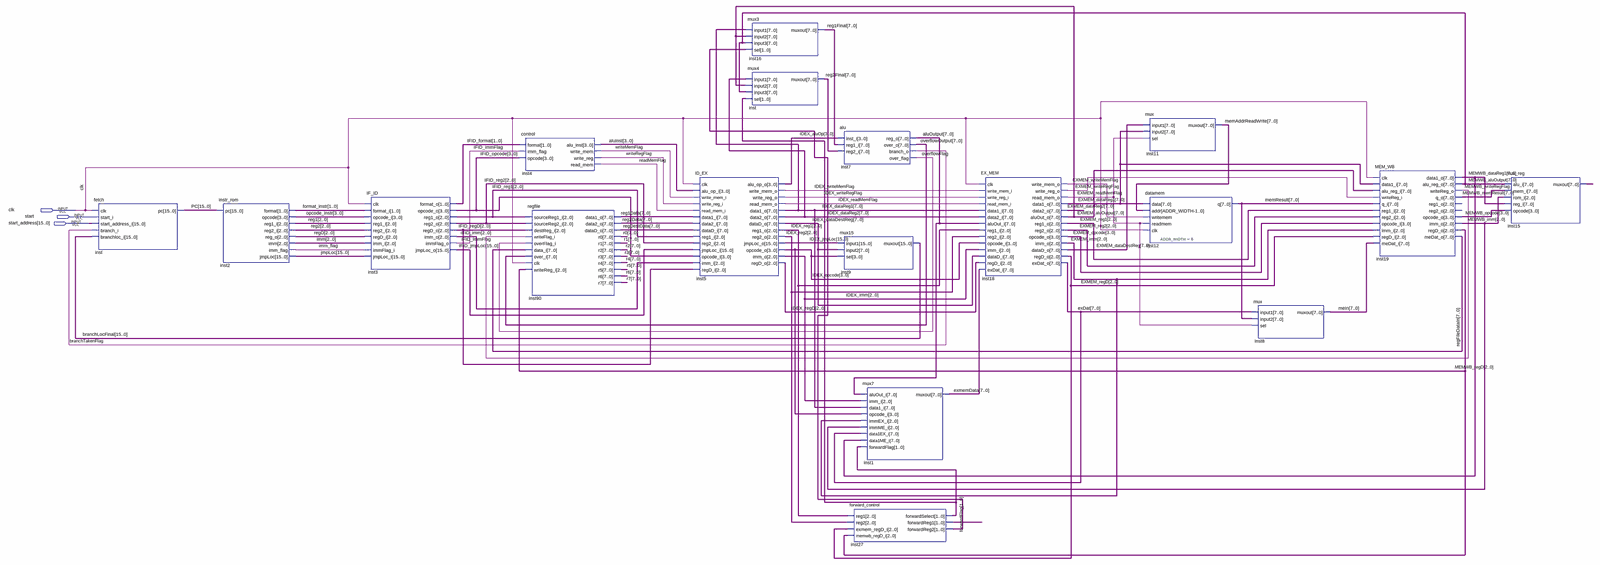
[diagram p0: schematic sheet, whole]
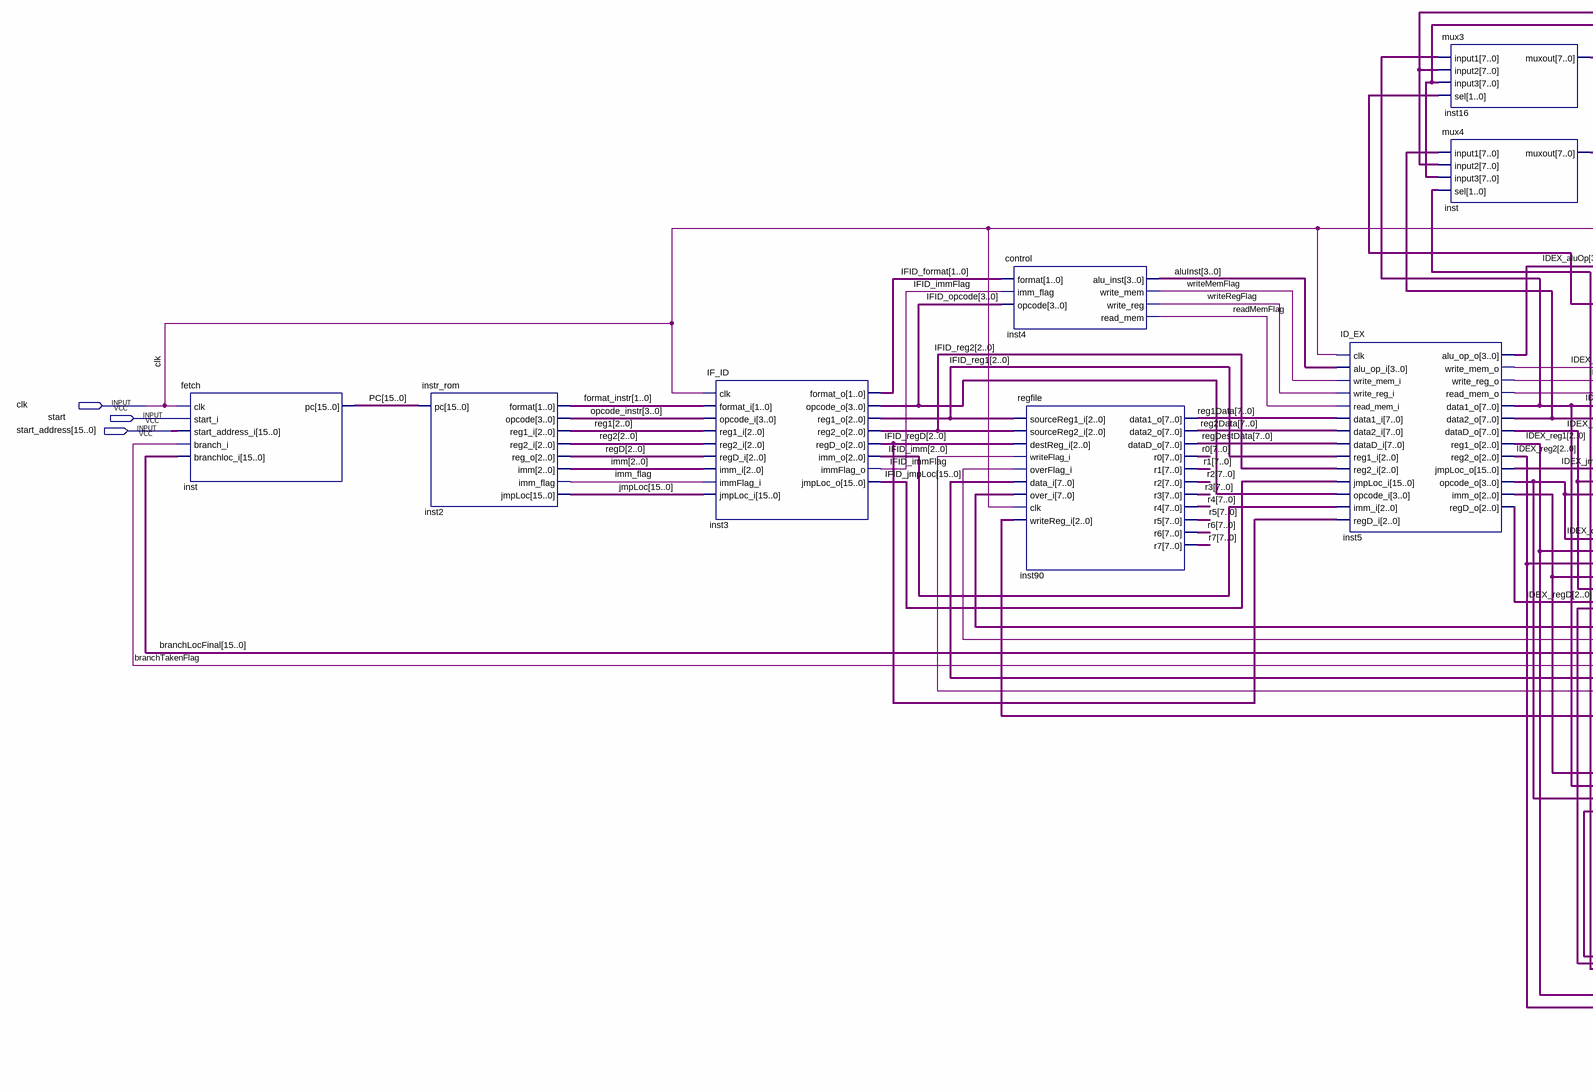
[diagram p1: schematic sheet, left part]
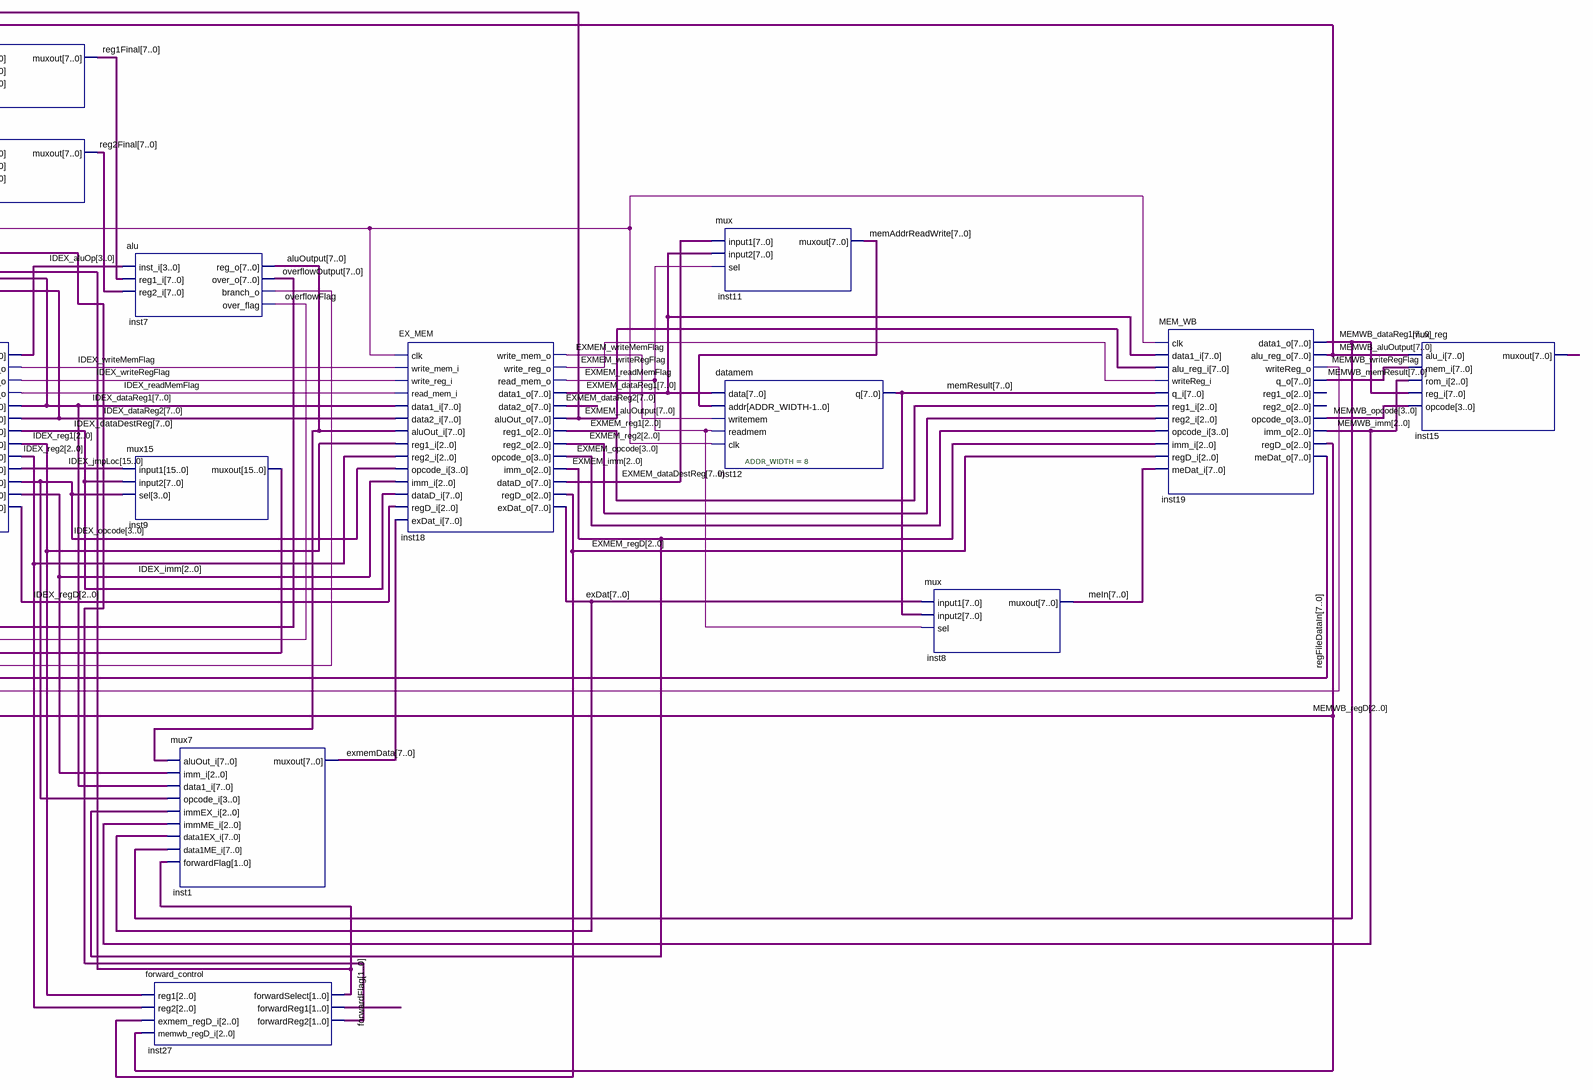
[diagram p2: schematic sheet, right part]
// Quartus schematic Lab2.bdf as structural Verilog: 18 symbols, 3 pins
module Lab2 (
  input  clk,
  input  start,
  input  [15:0] start_address
);

  wire branchTakenFlag, EXMEM_readMemFlag, EXMEM_writeMemFlag, EXMEM_writeRegFlag, IDEX_readMemFlag,
       IDEX_writeMemFlag, IDEX_writeRegFlag, IFID_immFlag, imm_flag, MEMWB_writeRegFlag, overflowFlag,
       readMemFlag, writeMemFlag, writeRegFlag;
  wire [1:0] format_instr, forwardFlag, IFID_format, inst27_forwardreg1, inst27_forwardreg2;
  wire [2:0] EXMEM_imm, EXMEM_reg1, EXMEM_reg2, EXMEM_regD, IDEX_imm, IDEX_reg1, IDEX_reg2, IDEX_regD,
       IFID_imm, IFID_reg1, IFID_reg2, IFID_regD, imm, MEMWB_imm, MEMWB_regD, reg1, reg2, regD;
  wire [3:0] aluInst, EXMEM_opcode, IDEX_aluOp, IDEX_opcode, IFID_opcode, MEMWB_opcode, opcode_instr;
  wire [7:0] aluOutput, exDat, EXMEM_aluOutput, EXMEM_dataDestReg, EXMEM_dataReg1, EXMEM_dataReg2, exmemData,
       IDEX_dataDestReg, IDEX_dataReg1, IDEX_dataReg2, inst15_muxout, meIn, memAddrReadWrite, memResult,
       MEMWB_aluOutput, MEMWB_dataReg1, MEMWB_memResult, overflowOutput, r0, r1, r2, r3, r4, r5, r6, r7,
       reg1Data, reg1Final, reg2Data, reg2Final, regDestData, regFileDataIn;
  wire [15:0] branchLocFinal, IDEX_jmpLoc, IFID_jmpLoc, jmpLoc, PC;

  fetch inst (
    .clk(clk), .start_i(start), .start_address_i(start_address), .branch_i(branchTakenFlag),
    .branchloc_i(branchLocFinal), .pc(PC));
  instr_rom inst2 (
    .pc(PC), .format(format_instr), .opcode(opcode_instr), .reg1_i(reg1), .reg2_i(reg2), .reg_o(regD),
    .imm(imm), .imm_flag(imm_flag), .jmpLoc(jmpLoc));
  IF_ID inst3 (
    .clk(clk), .format_i(format_instr), .opcode_i(opcode_instr), .reg1_i(reg1), .reg2_i(reg2), .regD_i(regD),
    .imm_i(imm), .immFlag_i(imm_flag), .jmpLoc_i(jmpLoc), .format_o(IFID_format), .opcode_o(IFID_opcode),
    .reg1_o(IFID_reg1), .reg2_o(IFID_reg2), .regD_o(IFID_regD), .imm_o(IFID_imm), .immFlag_o(IFID_immFlag),
    .jmpLoc_o(IFID_jmpLoc));
  control inst4 (
    .format(IFID_format), .imm_flag(IFID_immFlag), .opcode(IFID_opcode), .alu_inst(aluInst),
    .write_mem(writeMemFlag), .write_reg(writeRegFlag), .read_mem(readMemFlag));
  regfile inst90 (
    .sourceReg1_i(IFID_reg1), .sourceReg2_i(IFID_reg2), .destReg_i(IFID_regD),
    .writeFlag_i(MEMWB_writeRegFlag), .overFlag_i(overflowFlag), .data_i(regFileDataIn),
    .over_i(overflowOutput), .clk(clk), .writeReg_i(MEMWB_regD), .data1_o(reg1Data), .data2_o(reg2Data),
    .dataD_o(regDestData), .r0(r0), .r1(r1), .r2(r2), .r3(r3), .r4(r4), .r5(r5), .r6(r6), .r7(r7));
  ID_EX inst5 (
    .clk(clk), .alu_op_i(aluInst), .write_mem_i(writeMemFlag), .write_reg_i(writeRegFlag),
    .read_mem_i(readMemFlag), .data1_i(reg1Data), .data2_i(reg2Data), .dataD_i(regDestData),
    .reg1_i(IFID_reg1), .reg2_i(IFID_reg2), .jmpLoc_i(IFID_jmpLoc), .opcode_i(IFID_opcode), .imm_i(IFID_imm),
    .regD_i(IFID_regD), .alu_op_o(IDEX_aluOp), .write_mem_o(IDEX_writeMemFlag),
    .write_reg_o(IDEX_writeRegFlag), .read_mem_o(IDEX_readMemFlag), .data1_o(IDEX_dataReg1),
    .data2_o(IDEX_dataReg2), .dataD_o(IDEX_dataDestReg), .reg1_o(IDEX_reg1), .reg2_o(IDEX_reg2),
    .jmpLoc_o(IDEX_jmpLoc), .opcode_o(IDEX_opcode), .imm_o(IDEX_imm), .regD_o(IDEX_regD));
  mux3 inst16 (
    .input1(IDEX_dataReg1), .input2(EXMEM_aluOutput), .input3(MEMWB_aluOutput), .sel(inst27_forwardreg2),
    .muxout(reg1Final));
  mux4 inst_dup2 (
    .input1(IDEX_dataReg2), .input2(EXMEM_aluOutput), .input3(MEMWB_aluOutput), .sel(forwardFlag),
    .muxout(reg2Final));
  alu inst7 (
    .inst_i(IDEX_aluOp), .reg1_i(reg1Final), .reg2_i(reg2Final), .reg_o(aluOutput), .over_o(overflowOutput),
    .branch_o(branchTakenFlag), .over_flag(overflowFlag));
  mux15 inst9 (.input1(IDEX_jmpLoc), .input2(IDEX_dataDestReg), .sel(IDEX_opcode), .muxout(branchLocFinal));
  mux7 inst1 (
    .aluOut_i(aluOutput), .imm_i(IDEX_imm), .data1_i(IDEX_dataReg1), .opcode_i(IDEX_opcode),
    .immEX_i(EXMEM_imm), .immME_i(MEMWB_imm), .data1EX_i(exDat), .data1ME_i(MEMWB_dataReg1),
    .forwardFlag(forwardFlag), .muxout(exmemData));
  forward_control inst27 (
    .reg1(IDEX_reg1), .reg2(IDEX_reg2), .exmem_regD_i(EXMEM_regD), .memwb_regD_i(MEMWB_regD),
    .forwardSelect(forwardFlag), .forwardReg1(inst27_forwardreg1), .forwardReg2(inst27_forwardreg2));
  EX_MEM inst18 (
    .clk(clk), .write_mem_i(IDEX_writeMemFlag), .write_reg_i(IDEX_writeRegFlag),
    .read_mem_i(IDEX_readMemFlag), .data1_i(IDEX_dataReg1), .data2_i(IDEX_dataReg2), .aluOut_i(aluOutput),
    .reg1_i(IDEX_reg1), .reg2_i(IDEX_reg2), .opcode_i(IDEX_opcode), .imm_i(IDEX_imm),
    .dataD_i(IDEX_dataDestReg), .regD_i(IDEX_regD), .exDat_i(exmemData), .write_mem_o(EXMEM_writeMemFlag),
    .write_reg_o(EXMEM_writeRegFlag), .read_mem_o(EXMEM_readMemFlag), .data1_o(EXMEM_dataReg1),
    .data2_o(EXMEM_dataReg2), .aluOut_o(EXMEM_aluOutput), .reg1_o(EXMEM_reg1), .reg2_o(EXMEM_reg2),
    .opcode_o(EXMEM_opcode), .imm_o(EXMEM_imm), .dataD_o(EXMEM_dataDestReg), .regD_o(EXMEM_regD),
    .exDat_o(exDat));
  mux inst11 (.input1(EXMEM_dataDestReg), .input2(EXMEM_dataReg1), .sel(EXMEM_readMemFlag), .muxout(memAddrReadWrite));
  datamem #(.ADDR_WIDTH(8)) inst12 (
    .data(EXMEM_dataReg1), .addr(memAddrReadWrite), .writemem(EXMEM_writeMemFlag),
    .readmem(EXMEM_readMemFlag), .clk(clk), .q(memResult));
  mux inst8 (.input1(exDat), .input2(memResult), .sel(EXMEM_readMemFlag), .muxout(meIn));
  MEM_WB inst19 (
    .clk(clk), .data1_i(EXMEM_dataReg1), .alu_reg_i(EXMEM_aluOutput), .writeReg_i(EXMEM_writeRegFlag),
    .q_i(memResult), .reg1_i(EXMEM_reg1), .reg2_i(EXMEM_reg2), .opcode_i(EXMEM_opcode), .imm_i(EXMEM_imm),
    .regD_i(EXMEM_regD), .meDat_i(meIn), .data1_o(MEMWB_dataReg1), .alu_reg_o(MEMWB_aluOutput),
    .writeReg_o(MEMWB_writeRegFlag), .q_o(MEMWB_memResult), .opcode_o(MEMWB_opcode), .imm_o(MEMWB_imm),
    .regD_o(MEMWB_regD), .meDat_o(regFileDataIn));  // open: reg1_o, reg2_o
  mux_reg inst15 (
    .alu_i(MEMWB_aluOutput), .mem_i(MEMWB_memResult), .rom_i(MEMWB_imm), .reg_i(MEMWB_dataReg1),
    .opcode(MEMWB_opcode), .muxout(inst15_muxout));
endmodule
